# Altium schematic sheet LPCB235 - OVERVIEW.SchDoc
size A3; Address1: Unit 4; DocumentNumber: 1; Revision: 2; SheetNumber: 1; SheetTotal: 37; Lockie__PCB_SUB_ASSEMBLY: Overview; Lockie__PCB_ASSEMBLY: FCU PCB; Lockie__LDL: LPCB235; Lockie__PCB_DESCRIPTION: Flight Control Unit
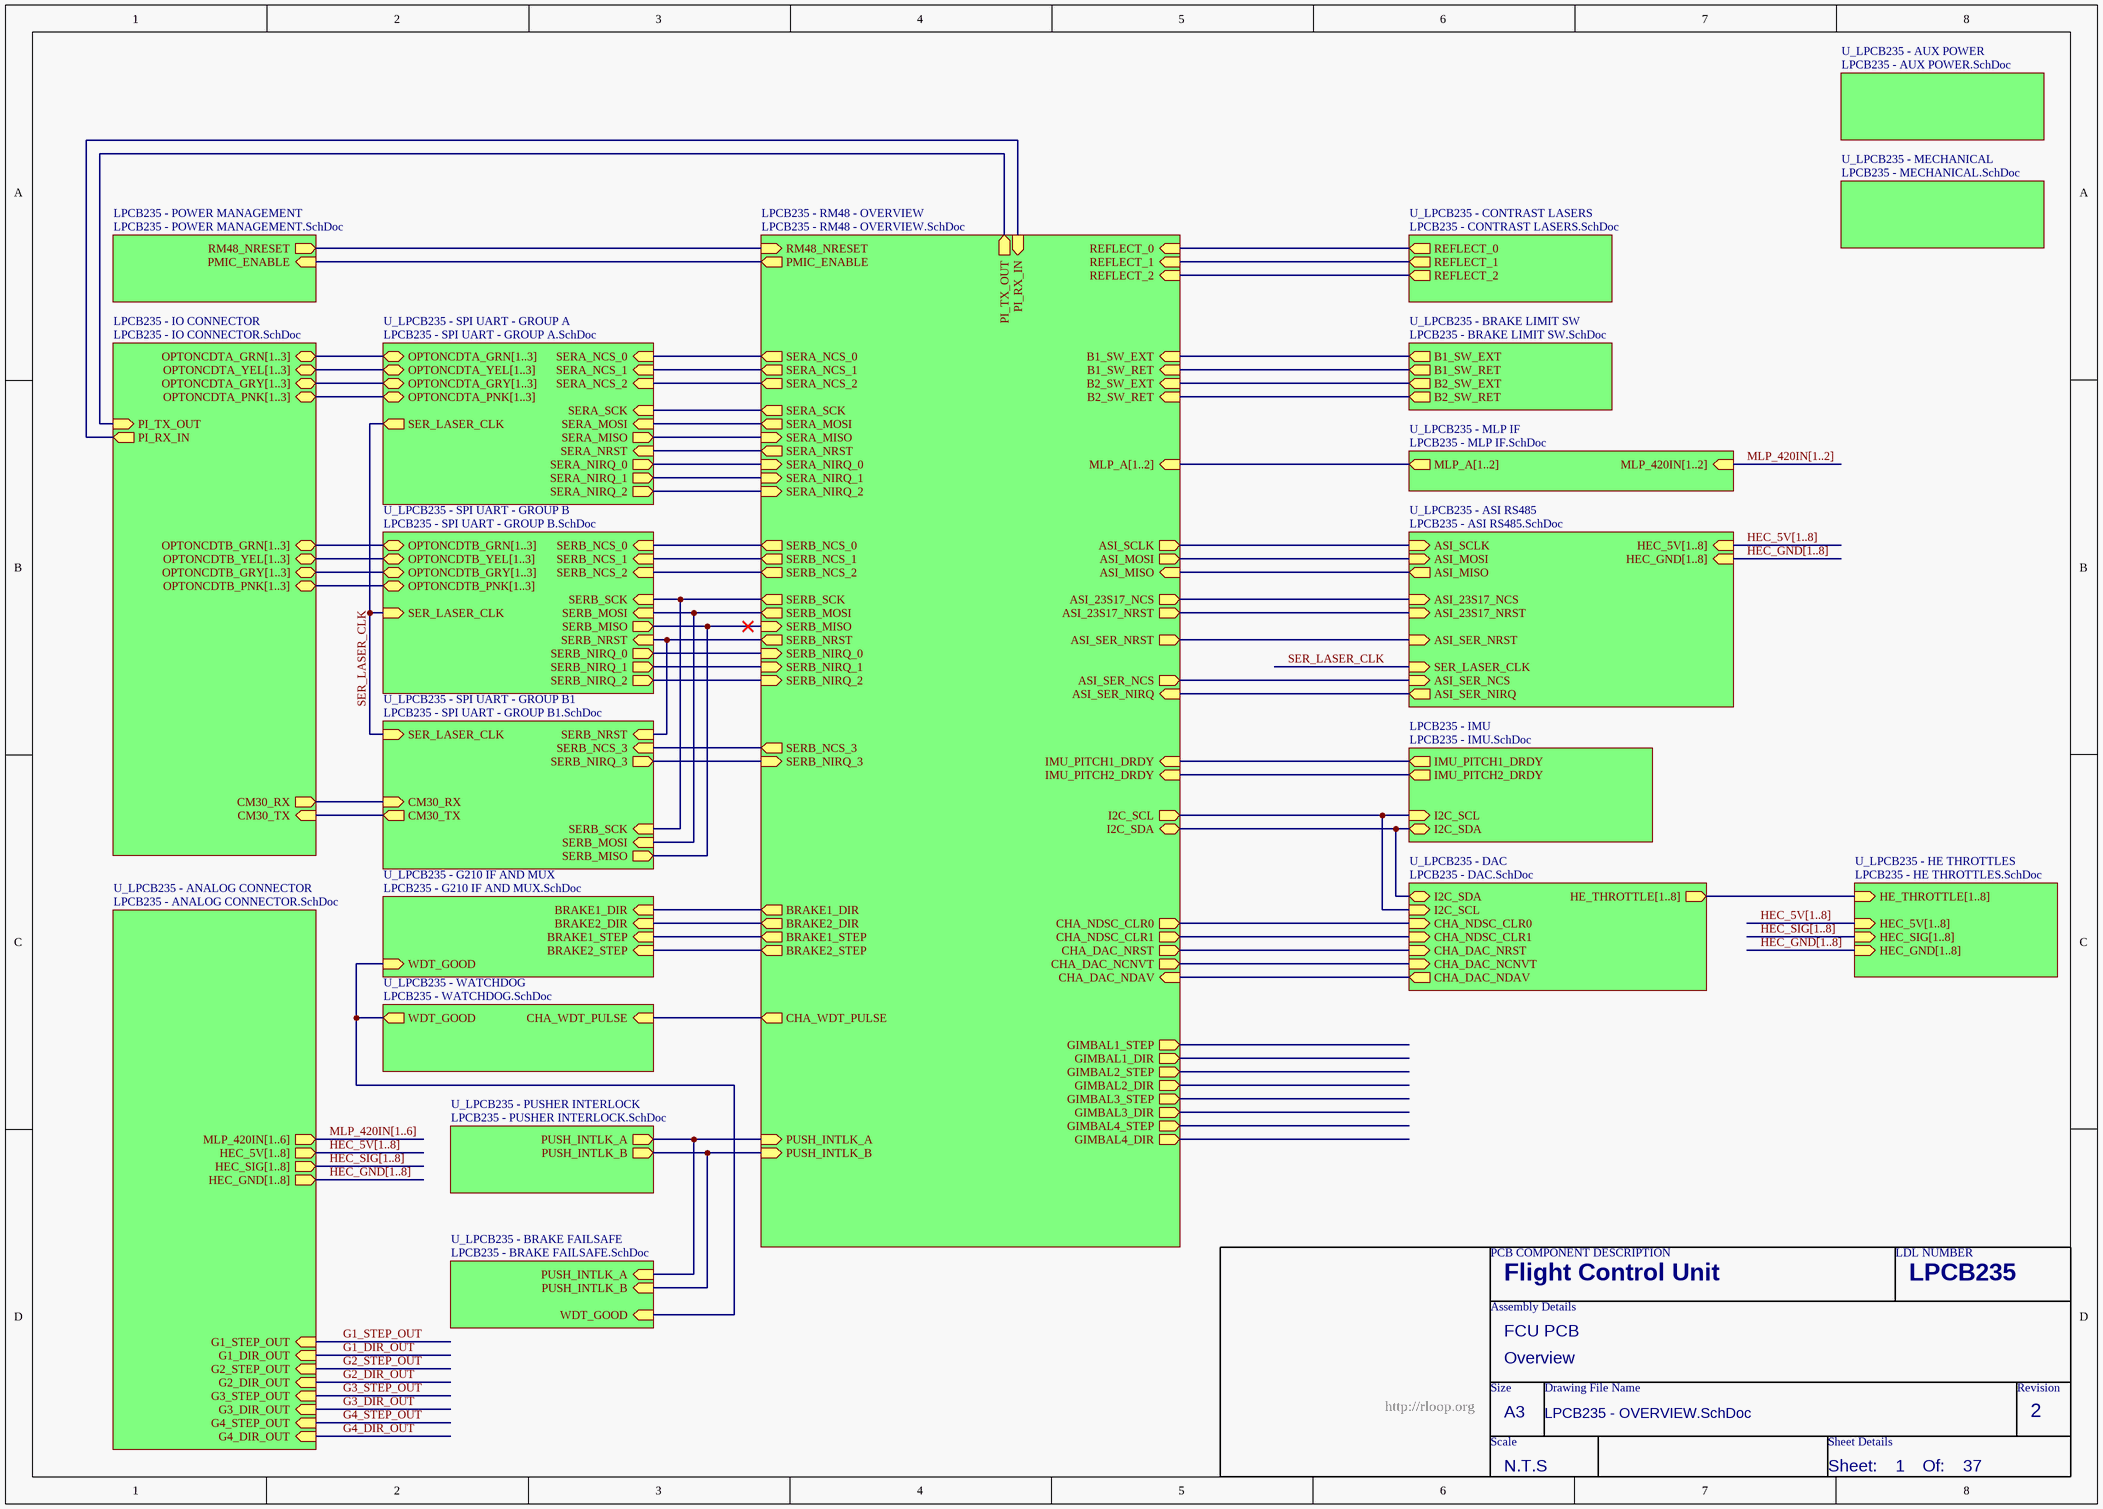
[diagram p0: LPCB235 - OVERVIEW.SchDoc]

## Sub-sheets
LPCB235 - IMU = LPCB235 - IMU.SchDoc: IMU_PITCH1_DRDY (out), IMU_PITCH2_DRDY (out), I2C_SCL (in), I2C_SDA (bidir)
LPCB235 - IO CONNECTOR = LPCB235 - IO CONNECTOR.SchDoc: OPTONCDTA_GRN[1..3] (bidir), OPTONCDTA_YEL[1..3] (bidir), OPTONCDTA_GRY[1..3] (bidir), OPTONCDTA_PNK[1..3] (bidir), OPTONCDTB_GRN[1..3] (bidir), OPTONCDTB_YEL[1..3] (bidir), OPTONCDTB_GRY[1..3] (bidir), OPTONCDTB_PNK[1..3] (bidir), CM30_RX (out), CM30_TX (in), PI_TX_OUT (in), PI_RX_IN (out)
LPCB235 - POWER MANAGEMENT = LPCB235 - POWER MANAGEMENT.SchDoc: PMIC_ENABLE (in), RM48_NRESET (out)
LPCB235 - RM48 - OVERVIEW = LPCB235 - RM48 - OVERVIEW.SchDoc: RM48_NRESET (in), PMIC_ENABLE (out), SERA_NRST (out), SERB_NRST (out), REFLECT_0 (in), REFLECT_1 (in), REFLECT_2 (in), MLP_A[1..2] (in), SERA_NIRQ_0 (in), SERA_NIRQ_1 (in), SERA_NIRQ_2 (in), SERA_NCS_0 (out), SERA_NCS_1 (out), SERA_NCS_2 (out), SERA_MISO (in), SERA_MOSI (out), SERA_SCK (out), IMU_PITCH1_DRDY (in), IMU_PITCH2_DRDY (in), SERB_MISO (in), SERB_MOSI (out), SERB_SCK (out), BRAKE2_DIR (out), BRAKE1_DIR (out), BRAKE2_STEP (out), BRAKE1_STEP (out), SERB_NCS_0 (out), SERB_NCS_1 (out), SERB_NIRQ_1 (in), CHA_WDT_PULSE (out), SERB_NIRQ_0 (in), I2C_SCL (out), I2C_SDA (bidir), PUSH_INTLK_A (in), B2_SW_EXT (in), SERB_NCS_2 (out), SERB_NCS_3 (out), SERB_NIRQ_2 (in), SERB_NIRQ_3 (in), PUSH_INTLK_B (in), B2_SW_RET (in), CHA_DAC_NDAV (in), B1_SW_EXT (in), B1_SW_RET (in), CHA_DAC_NRST (out), CHA_NDSC_CLR0 (out), CHA_NDSC_CLR1 (out), PI_TX_OUT (out), PI_RX_IN (in), CHA_DAC_NCNVT (out), ASI_MISO (in), ASI_MOSI (out), ASI_SCLK (out), ASI_23S17_NCS (out), ASI_23S17_NRST (out), ASI_SER_NCS (out), ASI_SER_NIRQ (in), ASI_SER_NRST (out), GIMBAL1_STEP (out), GIMBAL1_DIR (out), GIMBAL2_STEP (out), GIMBAL2_DIR (out), GIMBAL3_STEP (out), GIMBAL3_DIR (out), GIMBAL4_STEP (out), GIMBAL4_DIR (out)
U_LPCB235 - ANALOG CONNECTOR = LPCB235 - ANALOG CONNECTOR.SchDoc: HEC_5V[1..8] (out), HEC_SIG[1..8] (out), HEC_GND[1..8] (out), MLP_420IN[1..6] (out), G1_STEP_OUT (in), G1_DIR_OUT (in), G2_STEP_OUT (in), G2_DIR_OUT (in), G3_STEP_OUT (in), G3_DIR_OUT (in), G4_STEP_OUT (in), G4_DIR_OUT (in)
U_LPCB235 - ASI RS485 = LPCB235 - ASI RS485.SchDoc: ASI_SCLK (in), ASI_MOSI (in), ASI_MISO (out), ASI_23S17_NCS (in), ASI_23S17_NRST (in), SER_LASER_CLK (in), ASI_SER_NCS (in), ASI_SER_NRST (in), ASI_SER_NIRQ (out), HEC_5V[1..8] (in), HEC_GND[1..8] (in)
U_LPCB235 - AUX POWER = LPCB235 - AUX POWER.SchDoc: no entries
U_LPCB235 - BRAKE FAILSAFE = LPCB235 - BRAKE FAILSAFE.SchDoc: PUSH_INTLK_A (in), PUSH_INTLK_B (in), WDT_GOOD (in)
U_LPCB235 - BRAKE LIMIT SW = LPCB235 - BRAKE LIMIT SW.SchDoc: B1_SW_EXT (out), B1_SW_RET (out), B2_SW_EXT (out), B2_SW_RET (out)
U_LPCB235 - CONTRAST LASERS = LPCB235 - CONTRAST LASERS.SchDoc: REFLECT_0 (out), REFLECT_1 (out), REFLECT_2 (out)
U_LPCB235 - DAC = LPCB235 - DAC.SchDoc: HE_THROTTLE[1..8] (out), I2C_SDA (bidir), I2C_SCL (in), CHA_NDSC_CLR0 (in), CHA_NDSC_CLR1 (in), CHA_DAC_NRST (in), CHA_DAC_NDAV (out), CHA_DAC_NCNVT (in)
U_LPCB235 - G210 IF AND MUX = LPCB235 - G210 IF AND MUX.SchDoc: BRAKE1_DIR (in), BRAKE2_DIR (in), BRAKE1_STEP (in), BRAKE2_STEP (in), WDT_GOOD (in)
U_LPCB235 - HE THROTTLES = LPCB235 - HE THROTTLES.SchDoc: HE_THROTTLE[1..8] (in), HEC_5V[1..8] (in), HEC_SIG[1..8] (in), HEC_GND[1..8] (in)
U_LPCB235 - MECHANICAL = LPCB235 - MECHANICAL.SchDoc: no entries
U_LPCB235 - MLP IF = LPCB235 - MLP IF.SchDoc: MLP_A[1..2] (out), MLP_420IN[1..2] (in)
U_LPCB235 - PUSHER INTERLOCK = LPCB235 - PUSHER INTERLOCK.SchDoc: PUSH_INTLK_A (out), PUSH_INTLK_B (out)
U_LPCB235 - SPI UART - GROUP A = LPCB235 - SPI UART - GROUP A.SchDoc: SERA_NCS_0 (in), SERA_NCS_1 (in), SERA_NCS_2 (in), SERA_NRST (in), SERA_NIRQ_0 (out), SERA_NIRQ_1 (out), SERA_NIRQ_2 (out), SERA_SCK (in), SERA_MOSI (in), SERA_MISO (out), OPTONCDTA_GRN[1..3] (bidir), OPTONCDTA_YEL[1..3] (bidir), OPTONCDTA_GRY[1..3] (bidir), OPTONCDTA_PNK[1..3] (bidir), SER_LASER_CLK (out)
U_LPCB235 - SPI UART - GROUP B = LPCB235 - SPI UART - GROUP B.SchDoc: SERB_NCS_0 (in), SERB_NCS_1 (in), SERB_NCS_2 (in), SERB_NRST (in), SERB_NIRQ_0 (out), SERB_NIRQ_1 (out), SERB_NIRQ_2 (out), SERB_SCK (in), SERB_MOSI (in), SERB_MISO (out), OPTONCDTB_GRN[1..3] (bidir), OPTONCDTB_YEL[1..3] (bidir), OPTONCDTB_GRY[1..3] (bidir), OPTONCDTB_PNK[1..3] (bidir), SER_LASER_CLK (in)
U_LPCB235 - SPI UART - GROUP B1 = LPCB235 - SPI UART - GROUP B1.SchDoc: SERB_NCS_3 (in), SERB_NRST (in), SERB_NIRQ_3 (out), SERB_SCK (in), SERB_MOSI (in), SERB_MISO (out), SER_LASER_CLK (in), CM30_RX (in), CM30_TX (out)
U_LPCB235 - WATCHDOG = LPCB235 - WATCHDOG.SchDoc: CHA_WDT_PULSE (in), WDT_GOOD (out)

## Nets
G1_DIR_OUT: sheet U_LPCB235 - ANALOG CONNECTOR/G1_DIR_OUT
G1_STEP_OUT: sheet U_LPCB235 - ANALOG CONNECTOR/G1_STEP_OUT
G2_DIR_OUT: sheet U_LPCB235 - ANALOG CONNECTOR/G2_DIR_OUT
G2_STEP_OUT: sheet U_LPCB235 - ANALOG CONNECTOR/G2_STEP_OUT
G3_DIR_OUT: sheet U_LPCB235 - ANALOG CONNECTOR/G3_DIR_OUT
G3_STEP_OUT: sheet U_LPCB235 - ANALOG CONNECTOR/G3_STEP_OUT
G4_DIR_OUT: sheet U_LPCB235 - ANALOG CONNECTOR/G4_DIR_OUT
G4_STEP_OUT: sheet U_LPCB235 - ANALOG CONNECTOR/G4_STEP_OUT
SER_LASER_CLK: sheet U_LPCB235 - SPI UART - GROUP B/SER_LASER_CLK, sheet U_LPCB235 - SPI UART - GROUP A/SER_LASER_CLK, sheet U_LPCB235 - SPI UART - GROUP B1/SER_LASER_CLK, sheet U_LPCB235 - ASI RS485/SER_LASER_CLK
(unnamed): sheet LPCB235 - POWER MANAGEMENT/PMIC_ENABLE, sheet LPCB235 - RM48 - OVERVIEW/PMIC_ENABLE
(unnamed): sheet LPCB235 - POWER MANAGEMENT/RM48_NRESET, sheet LPCB235 - RM48 - OVERVIEW/RM48_NRESET
(unnamed): sheet LPCB235 - IO CONNECTOR/CM30_RX, sheet U_LPCB235 - SPI UART - GROUP B1/CM30_RX
(unnamed): sheet LPCB235 - IO CONNECTOR/CM30_TX, sheet U_LPCB235 - SPI UART - GROUP B1/CM30_TX
(unnamed): sheet LPCB235 - IO CONNECTOR/PI_TX_OUT, sheet LPCB235 - RM48 - OVERVIEW/PI_TX_OUT
(unnamed): sheet LPCB235 - IO CONNECTOR/PI_RX_IN, sheet LPCB235 - RM48 - OVERVIEW/PI_RX_IN
(unnamed): sheet LPCB235 - RM48 - OVERVIEW/SERA_NRST, sheet U_LPCB235 - SPI UART - GROUP A/SERA_NRST
(unnamed): sheet LPCB235 - RM48 - OVERVIEW/SERB_NRST, sheet U_LPCB235 - SPI UART - GROUP B/SERB_NRST, sheet U_LPCB235 - SPI UART - GROUP B1/SERB_NRST
(unnamed): sheet LPCB235 - RM48 - OVERVIEW/REFLECT_0, sheet U_LPCB235 - CONTRAST LASERS/REFLECT_0
(unnamed): sheet LPCB235 - RM48 - OVERVIEW/REFLECT_1, sheet U_LPCB235 - CONTRAST LASERS/REFLECT_1
(unnamed): sheet LPCB235 - RM48 - OVERVIEW/REFLECT_2, sheet U_LPCB235 - CONTRAST LASERS/REFLECT_2
(unnamed): sheet LPCB235 - RM48 - OVERVIEW/SERA_NIRQ_0, sheet U_LPCB235 - SPI UART - GROUP A/SERA_NIRQ_0
(unnamed): sheet LPCB235 - RM48 - OVERVIEW/SERA_NIRQ_1, sheet U_LPCB235 - SPI UART - GROUP A/SERA_NIRQ_1
(unnamed): sheet LPCB235 - RM48 - OVERVIEW/SERA_NIRQ_2, sheet U_LPCB235 - SPI UART - GROUP A/SERA_NIRQ_2
(unnamed): sheet LPCB235 - RM48 - OVERVIEW/SERA_NCS_0, sheet U_LPCB235 - SPI UART - GROUP A/SERA_NCS_0
(unnamed): sheet LPCB235 - RM48 - OVERVIEW/SERA_NCS_1, sheet U_LPCB235 - SPI UART - GROUP A/SERA_NCS_1
(unnamed): sheet LPCB235 - RM48 - OVERVIEW/SERA_NCS_2, sheet U_LPCB235 - SPI UART - GROUP A/SERA_NCS_2
(unnamed): sheet LPCB235 - RM48 - OVERVIEW/SERA_MISO, sheet U_LPCB235 - SPI UART - GROUP A/SERA_MISO
(unnamed): sheet LPCB235 - RM48 - OVERVIEW/SERA_MOSI, sheet U_LPCB235 - SPI UART - GROUP A/SERA_MOSI
(unnamed): sheet LPCB235 - RM48 - OVERVIEW/SERA_SCK, sheet U_LPCB235 - SPI UART - GROUP A/SERA_SCK
(unnamed): sheet LPCB235 - RM48 - OVERVIEW/IMU_PITCH1_DRDY, sheet LPCB235 - IMU/IMU_PITCH1_DRDY
(unnamed): sheet LPCB235 - RM48 - OVERVIEW/IMU_PITCH2_DRDY, sheet LPCB235 - IMU/IMU_PITCH2_DRDY
(unnamed): sheet LPCB235 - RM48 - OVERVIEW/SERB_MISO, sheet U_LPCB235 - SPI UART - GROUP B/SERB_MISO, sheet U_LPCB235 - SPI UART - GROUP B1/SERB_MISO
(unnamed): sheet LPCB235 - RM48 - OVERVIEW/SERB_MOSI, sheet U_LPCB235 - SPI UART - GROUP B/SERB_MOSI, sheet U_LPCB235 - SPI UART - GROUP B1/SERB_MOSI
(unnamed): sheet LPCB235 - RM48 - OVERVIEW/SERB_SCK, sheet U_LPCB235 - SPI UART - GROUP B/SERB_SCK, sheet U_LPCB235 - SPI UART - GROUP B1/SERB_SCK
(unnamed): sheet LPCB235 - RM48 - OVERVIEW/BRAKE2_DIR, sheet U_LPCB235 - G210 IF AND MUX/BRAKE2_DIR
(unnamed): sheet LPCB235 - RM48 - OVERVIEW/BRAKE1_DIR, sheet U_LPCB235 - G210 IF AND MUX/BRAKE1_DIR
(unnamed): sheet LPCB235 - RM48 - OVERVIEW/BRAKE2_STEP, sheet U_LPCB235 - G210 IF AND MUX/BRAKE2_STEP
(unnamed): sheet LPCB235 - RM48 - OVERVIEW/BRAKE1_STEP, sheet U_LPCB235 - G210 IF AND MUX/BRAKE1_STEP
(unnamed): sheet LPCB235 - RM48 - OVERVIEW/SERB_NCS_0, sheet U_LPCB235 - SPI UART - GROUP B/SERB_NCS_0
(unnamed): sheet LPCB235 - RM48 - OVERVIEW/SERB_NCS_1, sheet U_LPCB235 - SPI UART - GROUP B/SERB_NCS_1
(unnamed): sheet LPCB235 - RM48 - OVERVIEW/SERB_NIRQ_1, sheet U_LPCB235 - SPI UART - GROUP B/SERB_NIRQ_1
(unnamed): sheet LPCB235 - RM48 - OVERVIEW/CHA_WDT_PULSE, sheet U_LPCB235 - WATCHDOG/CHA_WDT_PULSE
(unnamed): sheet LPCB235 - RM48 - OVERVIEW/SERB_NIRQ_0, sheet U_LPCB235 - SPI UART - GROUP B/SERB_NIRQ_0
(unnamed): sheet LPCB235 - RM48 - OVERVIEW/I2C_SCL, sheet LPCB235 - IMU/I2C_SCL, sheet U_LPCB235 - DAC/I2C_SCL
(unnamed): sheet LPCB235 - RM48 - OVERVIEW/I2C_SDA, sheet LPCB235 - IMU/I2C_SDA, sheet U_LPCB235 - DAC/I2C_SDA
(unnamed): sheet LPCB235 - RM48 - OVERVIEW/PUSH_INTLK_A, sheet U_LPCB235 - BRAKE FAILSAFE/PUSH_INTLK_A, sheet U_LPCB235 - PUSHER INTERLOCK/PUSH_INTLK_A
(unnamed): sheet LPCB235 - RM48 - OVERVIEW/B2_SW_EXT, sheet U_LPCB235 - BRAKE LIMIT SW/B2_SW_EXT
(unnamed): sheet LPCB235 - RM48 - OVERVIEW/SERB_NCS_2, sheet U_LPCB235 - SPI UART - GROUP B/SERB_NCS_2
(unnamed): sheet LPCB235 - RM48 - OVERVIEW/SERB_NCS_3, sheet U_LPCB235 - SPI UART - GROUP B1/SERB_NCS_3
(unnamed): sheet LPCB235 - RM48 - OVERVIEW/SERB_NIRQ_2, sheet U_LPCB235 - SPI UART - GROUP B/SERB_NIRQ_2
(unnamed): sheet LPCB235 - RM48 - OVERVIEW/SERB_NIRQ_3, sheet U_LPCB235 - SPI UART - GROUP B1/SERB_NIRQ_3
(unnamed): sheet LPCB235 - RM48 - OVERVIEW/PUSH_INTLK_B, sheet U_LPCB235 - BRAKE FAILSAFE/PUSH_INTLK_B, sheet U_LPCB235 - PUSHER INTERLOCK/PUSH_INTLK_B
(unnamed): sheet LPCB235 - RM48 - OVERVIEW/B2_SW_RET, sheet U_LPCB235 - BRAKE LIMIT SW/B2_SW_RET
(unnamed): sheet LPCB235 - RM48 - OVERVIEW/CHA_DAC_NDAV, sheet U_LPCB235 - DAC/CHA_DAC_NDAV
(unnamed): sheet LPCB235 - RM48 - OVERVIEW/B1_SW_EXT, sheet U_LPCB235 - BRAKE LIMIT SW/B1_SW_EXT
(unnamed): sheet LPCB235 - RM48 - OVERVIEW/B1_SW_RET, sheet U_LPCB235 - BRAKE LIMIT SW/B1_SW_RET
(unnamed): sheet LPCB235 - RM48 - OVERVIEW/CHA_DAC_NRST, sheet U_LPCB235 - DAC/CHA_DAC_NRST
(unnamed): sheet LPCB235 - RM48 - OVERVIEW/CHA_NDSC_CLR0, sheet U_LPCB235 - DAC/CHA_NDSC_CLR0
(unnamed): sheet LPCB235 - RM48 - OVERVIEW/CHA_NDSC_CLR1, sheet U_LPCB235 - DAC/CHA_NDSC_CLR1
(unnamed): sheet LPCB235 - RM48 - OVERVIEW/CHA_DAC_NCNVT, sheet U_LPCB235 - DAC/CHA_DAC_NCNVT
(unnamed): sheet LPCB235 - RM48 - OVERVIEW/ASI_MISO, sheet U_LPCB235 - ASI RS485/ASI_MISO
(unnamed): sheet LPCB235 - RM48 - OVERVIEW/ASI_MOSI, sheet U_LPCB235 - ASI RS485/ASI_MOSI
(unnamed): sheet LPCB235 - RM48 - OVERVIEW/ASI_SCLK, sheet U_LPCB235 - ASI RS485/ASI_SCLK
(unnamed): sheet LPCB235 - RM48 - OVERVIEW/ASI_23S17_NCS, sheet U_LPCB235 - ASI RS485/ASI_23S17_NCS
(unnamed): sheet LPCB235 - RM48 - OVERVIEW/ASI_23S17_NRST, sheet U_LPCB235 - ASI RS485/ASI_23S17_NRST
(unnamed): sheet LPCB235 - RM48 - OVERVIEW/ASI_SER_NCS, sheet U_LPCB235 - ASI RS485/ASI_SER_NCS
(unnamed): sheet LPCB235 - RM48 - OVERVIEW/ASI_SER_NIRQ, sheet U_LPCB235 - ASI RS485/ASI_SER_NIRQ
(unnamed): sheet LPCB235 - RM48 - OVERVIEW/ASI_SER_NRST, sheet U_LPCB235 - ASI RS485/ASI_SER_NRST
(unnamed): sheet U_LPCB235 - WATCHDOG/WDT_GOOD, sheet U_LPCB235 - BRAKE FAILSAFE/WDT_GOOD, sheet U_LPCB235 - G210 IF AND MUX/WDT_GOOD

## Buses and harness runs
bus HEC_5V[1..8] = sheet U_LPCB235 - ANALOG CONNECTOR/HEC_5V[1..8]
bus HEC_5V[1..8] = sheet U_LPCB235 - ASI RS485/HEC_5V[1..8]
bus HEC_5V[1..8] = sheet U_LPCB235 - HE THROTTLES/HEC_5V[1..8]
bus HEC_GND[1..8] = sheet U_LPCB235 - ANALOG CONNECTOR/HEC_GND[1..8]
bus HEC_GND[1..8] = sheet U_LPCB235 - ASI RS485/HEC_GND[1..8]
bus HEC_GND[1..8] = sheet U_LPCB235 - HE THROTTLES/HEC_GND[1..8]
bus HEC_SIG[1..8] = sheet U_LPCB235 - ANALOG CONNECTOR/HEC_SIG[1..8]
bus HEC_SIG[1..8] = sheet U_LPCB235 - HE THROTTLES/HEC_SIG[1..8]
bus MLP_420IN[1..2] = sheet U_LPCB235 - MLP IF/MLP_420IN[1..2]
bus MLP_420IN[1..6] = sheet U_LPCB235 - ANALOG CONNECTOR/MLP_420IN[1..6]
bus sheet LPCB235 - IO CONNECTOR/OPTONCDTA_GRN[1..3] = sheet U_LPCB235 - SPI UART - GROUP A/OPTONCDTA_GRN[1..3]
bus sheet LPCB235 - IO CONNECTOR/OPTONCDTA_GRY[1..3] = sheet U_LPCB235 - SPI UART - GROUP A/OPTONCDTA_GRY[1..3]
bus sheet LPCB235 - IO CONNECTOR/OPTONCDTA_PNK[1..3] = sheet U_LPCB235 - SPI UART - GROUP A/OPTONCDTA_PNK[1..3]
bus sheet LPCB235 - IO CONNECTOR/OPTONCDTA_YEL[1..3] = sheet U_LPCB235 - SPI UART - GROUP A/OPTONCDTA_YEL[1..3]
bus sheet LPCB235 - IO CONNECTOR/OPTONCDTB_GRN[1..3] = sheet U_LPCB235 - SPI UART - GROUP B/OPTONCDTB_GRN[1..3]
bus sheet LPCB235 - IO CONNECTOR/OPTONCDTB_GRY[1..3] = sheet U_LPCB235 - SPI UART - GROUP B/OPTONCDTB_GRY[1..3]
bus sheet LPCB235 - IO CONNECTOR/OPTONCDTB_PNK[1..3] = sheet U_LPCB235 - SPI UART - GROUP B/OPTONCDTB_PNK[1..3]
bus sheet LPCB235 - IO CONNECTOR/OPTONCDTB_YEL[1..3] = sheet U_LPCB235 - SPI UART - GROUP B/OPTONCDTB_YEL[1..3]
bus sheet LPCB235 - RM48 - OVERVIEW/MLP_A[1..2] = sheet U_LPCB235 - MLP IF/MLP_A[1..2]
bus sheet U_LPCB235 - DAC/HE_THROTTLE[1..8] = sheet U_LPCB235 - HE THROTTLES/HE_THROTTLE[1..8]

## Notes on the sheet
- PCB COMPONENT DESCRIPTION
- LDL NUMBER
- Assembly Details
- Size
- Drawing File Name
- Revision
- http://rloop.org
- Scale
- A3
- Sheet Details
- N.T.S
- Sheet:
- Of: